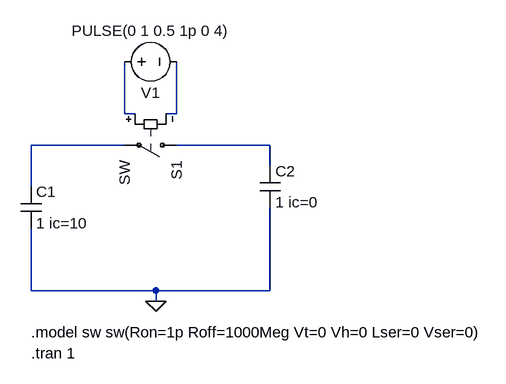
[diagram p0: schematic g4_p9.asc]
g4_p9.asc, the LTspice schematic file:
Version 4
SHEET 1 1308 680
WIRE 144 64 144 -16
WIRE 160 64 144 64
WIRE 224 64 224 -16
WIRE 224 64 208 64
WIRE 144 112 0 112
WIRE 368 112 224 112
WIRE 368 144 368 112
WIRE 0 176 0 112
WIRE 0 336 0 240
WIRE 192 336 0 336
WIRE 368 336 368 208
WIRE 368 336 192 336
WIRE 192 352 192 336
FLAG 192 352 0
SYMBOL cap -16 176 R0
SYMATTR InstName C1
SYMATTR Value 1 ic=10
SYMBOL cap 352 144 R0
SYMATTR InstName C2
SYMATTR Value 1 ic=0
SYMBOL sw 240 112 R90
SYMATTR InstName S1
SYMBOL voltage 128 -16 R270
WINDOW 0 -32 56 VBottom 2
WINDOW 3 32 56 VTop 2
WINDOW 123 0 0 Left 0
WINDOW 39 0 0 Left 0
SYMATTR InstName V1
SYMATTR Value PULSE(0 1 0.5 1p 0 4)
TEXT 0 432 Left 2 !.tran 1
TEXT 0 400 Left 2 !.model sw sw(Ron=1p Roff=1000Meg Vt=0 Vh=0 Lser=0 Vser=0)

The netlist it stands for:
* g4_p9.asc
C1 N003 0 1 ic=10
C2 N004 0 1 ic=0
S1 N004 N003 N001 N002 SW
V1 N001 N002 PULSE(0 1 0.5 1p 0 4)
.tran 1
.model sw sw(Ron=1p Roff=1000Meg Vt=0 Vh=0 Lser=0 Vser=0)
.backanno
.end